# Altium schematic sheet LevelShifter.SchDoc: Top Sheet
size A4; Project: World Domination Satellite
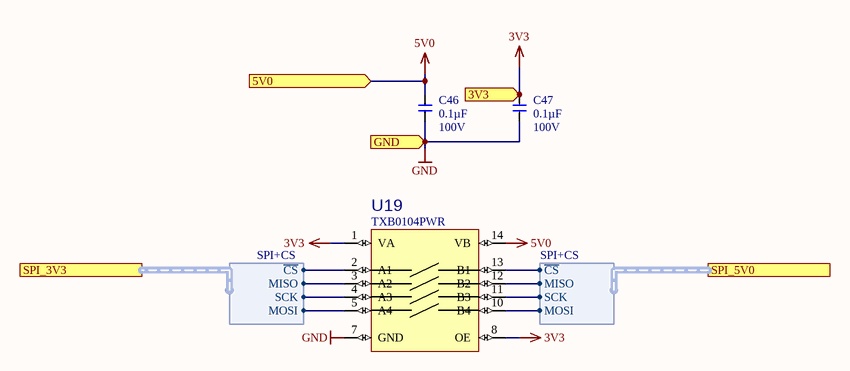
[diagram p0: LevelShifter.SchDoc]

## Parts
C46  Voltage - Rated: 100V  Capacitance: 0.1µF  [C0603]  (hidden comment: CAP_CER_100NF_100V)
C47  Voltage - Rated: 100V  Capacitance: 0.1µF  [C0603]  (hidden comment: CAP_CER_100NF_100V)
U19  Manufacturer Part Number: TXB0104PWR  [14TSSOP65]  (hidden comment: LVLSHFT_TXB0104PWR)

## Ports
3V3 (in), 5V0 (in), GND (in), SPI_3V3 (harness SPI+CS), SPI_5V0 (harness SPI+CS)

## Harnesses
SPI+CS: ~{CS}, MISO, MOSI, SCK

## Nets
3V3: C47.1 U19.1(VA) U19.8(OE) ; port 3V3
5V0: C46.1 U19.14(VB) ; port 5V0
GND: C46.2 C47.2 U19.7(GND) ; port GND
NetU19_2: U19.2(A1) ; port SPI_3V3.~{CS}
NetU19_3: U19.3(A2) ; port SPI_3V3.MISO
NetU19_4: U19.4(A3) ; port SPI_3V3.SCK
NetU19_5: U19.5(A4) ; port SPI_3V3.MOSI
NetU19_10: U19.10(B4) ; port SPI_5V0.MOSI
NetU19_11: U19.11(B3) ; port SPI_5V0.SCK
NetU19_12: U19.12(B2) ; port SPI_5V0.MISO
NetU19_13: U19.13(B1) ; port SPI_5V0.~{CS}

## Notes on the sheet
- Title
- Size:
- Date:
- A4
- Number:
- Time:
- Revision:
- Sheet
- of
- File:

## Library data of the parts
C46 C47 = CMP-027-0018-1: CAP CER 0.1UF 100V X7S 0603; Manufacturer: TDK Corporation; Manufacturer Part Number: C1608X7S2A104K080AB; Tolerance: ±10%; Failure Rate: -; Mounting Type: Surface Mount, MLCC; Pricing 1: 1=0.19, 10=0.133, 100=0.0673, 500=0.04604, 1000=0.04073 (USD); RoHS: RoHS Compliant; ComponentLink1Description: https://product.tdk.com/info/en/catalog/datasheets/mlcc_commercial_midvoltage_en.pdf; Features: -; Design Item ID: CAP_CER_100NF_100V; Lead Spacing: -; Source: capacitor.SchLib; Packaging: Cut Tape (CT); Lead Style: -; Ratings: -; Part Status: Active; Temperature Coefficient: X7S; Operating Temperature: -55°C ~ 125°C; ComponentLink1URL: https://product.tdk.com/info/en/catalog/datasheets/mlcc_commercial_midvoltage_en.pdf; Stock 1: 662530; Size / Dimension: 0.063" L x 0.031" W (1.60mm x 0.80mm); Applications: General Purpose; Package / Case: 0603 (1608 Metric); Thickness (Max): 0.037" (0.95mm); Height - Seated (Max): -
U19 = CMP-045-0016-1: 4 Pin Bidirectional levelshifter 5v-3.3v; Manufacturer: Texas Instruments; Translator Type: Voltage Level; Number of Circuits: 1; Channels per Circuit: 4; Voltage - VCCA: 1.2 V ~ 3.6 V; Voltage - VCCB: 1.65 V ~ 5.5 V; Output Type: Tri-State, Non-Inverted; Data Rate: 100Mbps; Value: *; RoHS: RoHS Compliant; Stock 1: 16134; Pricing 1: 1=1.39, 10=1.246, 100=0.9717, 500=0.8036, 1000=0.6355 (USD); Packaging: Cut Tape (CT); Channel Type: Bidirectional; Input Signal: -; Output Signal: -; Operating Temperature: -40°C ~ 85°C (TA); Features: Auto-Direction Sensing; Mounting Type: Surface Mount; Package / Case: 14-TSSOP (0.173", 4.40mm Width); Supplier Device Package: 14-TSSOP; ComponentLink1URL: http://www.ti.com/lit/ds/symlink/txb0104.pdf; ComponentLink1Description: http://www.ti.com/lit/ds/symlink/txb0104.pdf; Source: ic_interface.SchLib; Design Item ID: LVLSHFT_TXB0104PWR